# EAGLE design psxpwr (EAGLE 9.5.1)
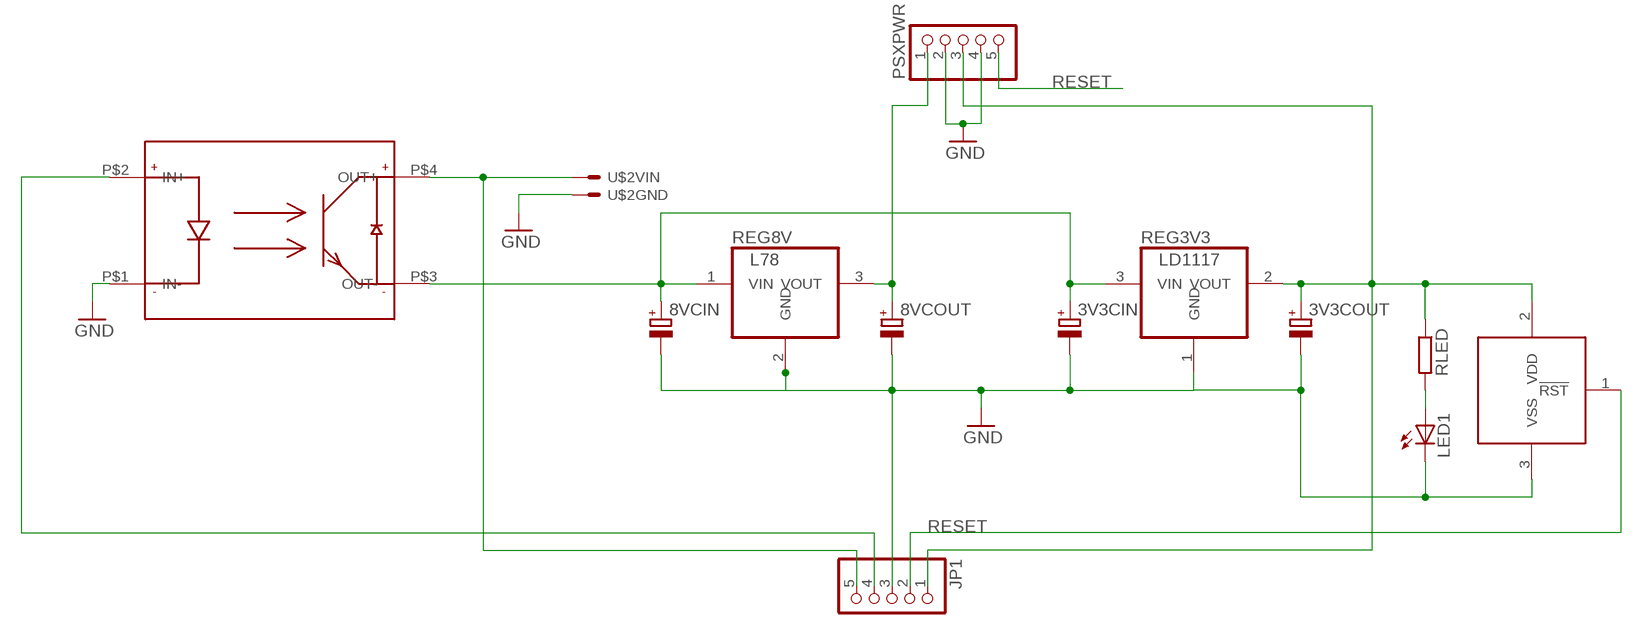
[diagram p0: schematic, sheet 1]

## Parts
3V3CIN  CPOL-EUE2.5-6  [E2,5-6]
3V3COUT  CPOL-EUE2.5-6  [E2,5-6]
8VCIN  CPOL-EUE2.5-6  [E2,5-6]
8VCOUT  CPOL-EUE2.5-6  [E2,5-6]
JP1  PINHD-1X5  [1X05]
LED1  LED3MM  [LED3MM]
PSXPWR  PINHD-1X5  [1X05]
REG3V3  LD1117  [TO-220-HEATSINK]
REG8V  L78  [TO-220-HEATSINK]
RESET  MCP100V3  [TO92-EBC-OVAL]
RLED  R-EU_0207/2V  [0207/2V]
U$1  KF060XD  [KF060XD]
U$2  PWR  [PWR]

## Nets
3V3: 3V3COUT.+ JP1.1 PSXPWR.3 REG3V3.2(VOUT) RESET.2(VDD) RLED.1
8V: 8VCOUT.+ PSXPWR.1 REG8V.3(VOUT)
12V: 3V3CIN.+ 8VCIN.+ REG3V3.3(VIN) REG8V.1(VIN) U$1.P$3(OUT-)
GND: 3V3CIN.- 3V3COUT.- 8VCIN.- 8VCOUT.- JP1.3 LED1.K(C) PSXPWR.2 PSXPWR.4 REG3V3.1(GND) REG8V.2(GND) RESET.3(VSS) U$1.P$1(IN-) U$2.P$1
LED: LED1.A RLED.2
PON: JP1.4 U$1.P$2(IN+)
RESET: JP1.2 PSXPWR.5 RESET.1(!RST)
VIN: JP1.5 U$1.P$4(OUT+) U$2.P$2

## Library data of the parts
3V3CIN 3V3COUT 8VCIN 8VCOUT = rcl:CPOL-EU: POLARIZED CAPACITOR, European symbol; SPICEPREFIX: C
JP1 PSXPWR = pinhead:PINHD-1X5: PIN HEADER
LED1 = adafruit:LED: LED OSRAM: - CHIPLED LG R971, LG N971, LY N971, LG Q971, LY Q971, LO R971, LY R971 LH N974, LH R974 LS Q976, LO Q976, LY Q976 LO Q996 - Hyper CHIPLED LW Q18S LB Q993, LB Q99A, LB R99A - SideLED LS A670, LO A670, LY A670, LG A670, LP A670 LB A673, LV A673, LT A673, LW A673 LH A674 LY A675 LS A676, LA A676, LO A676, LY A676, LW A676 LS A679, LY A679, LG A679 - Hyper Micro SIDELED® LS Y876, LA Y876, LO Y876, LY Y876 LT Y87S - SmartLED LW L88C, LW L88S LB L89C, LB L89S, LG L890 LS L89K, LO L89K, LY L89K LS L896, LA L896, LO L896, LY L896 - TOPLED LS T670, LO T670, LY T670, LG T670, LP T670 LSG T670, LSP T670, LSY T670, LOP T670, LYG T670 LG T671, LOG T671, LSG T671 LB T673, LV T673, LT T673, LW T673 LH T674 LS T676, LA T676, LO T676, LY T676, LB T676, LH T676, LSB T676, LW T676 LB T67C, LV T67C, LT T67C, LS T67K, LO T67K, LY T67K, LW E67C LS E67B, LA E67B, LO E67B, LY E67B, LB E67C, LV E67C, LT E67C LW T67C LS T679, LY T679, LG T679 LS T770, LO T770, LY T770, LG T770, LP T770 LB T773, LV T773, LT T773, LW T773 LH T774 LS E675, LA E675, LY E675, LS T675 LS T776, LA T776, LO T776, LY T776, LB T776 LHGB T686 LT T68C, LB T68C - Hyper Mini TOPLED® LB M676 - Mini TOPLED Santana® LG M470 LS M47K, LO M47K, LY M47K Source: http://www.osram.convergy.de/
REG3V3 = pixel:LD1117
REG8V = pixel:L78
RESET = pixel:MCP100
RLED = rcl:R-EU_: RESISTOR, European symbol; SPICEPREFIX: R
U$1 = pixel:KF060XD
U$2 = pixel:PWR

## Board
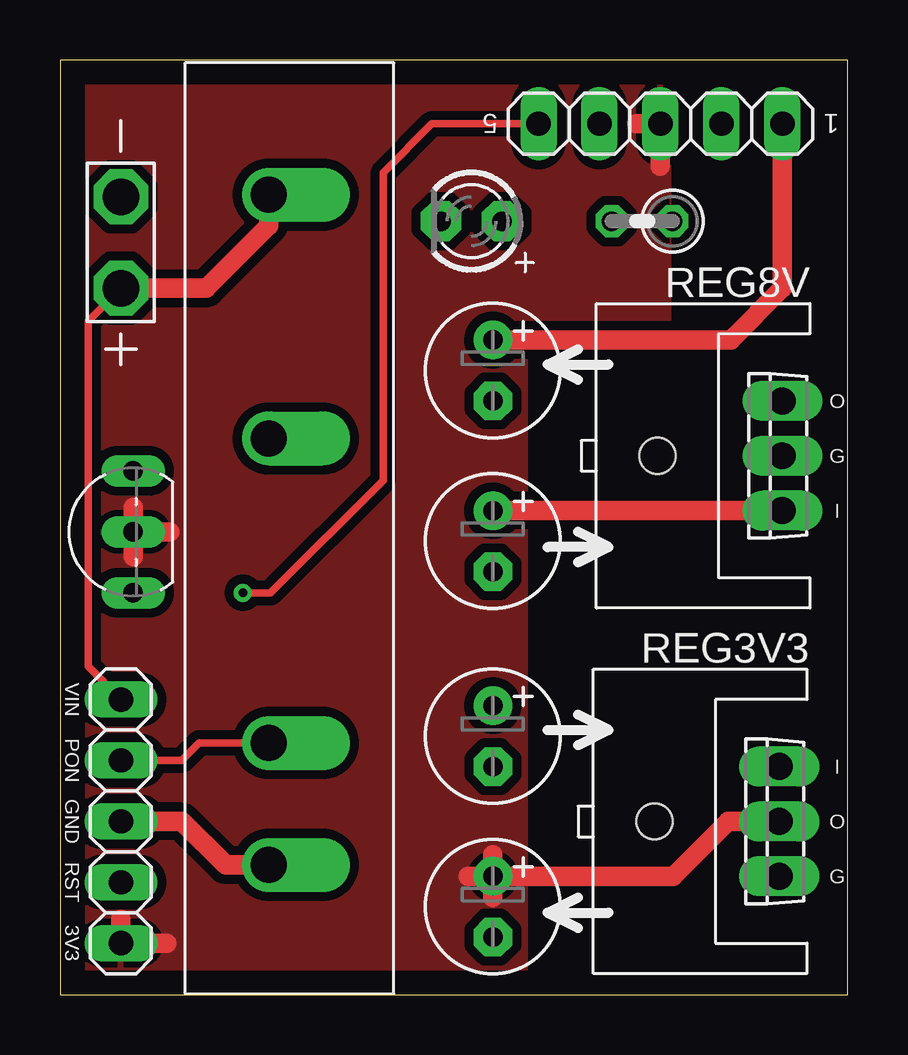
[diagram p1: board, top side]
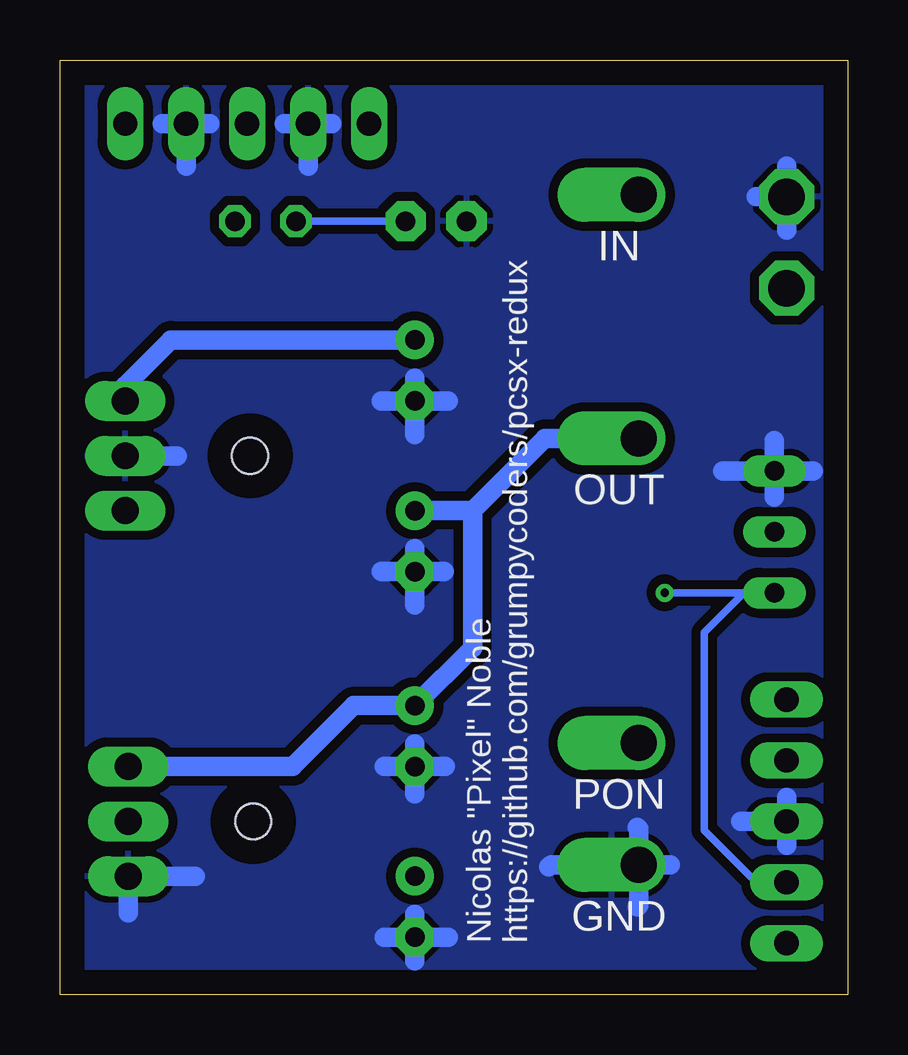
[diagram p2: board, bottom side, seen from below]

Size 32.82 x 38.98 mm. Coordinates in mm from the lower left corner, seen from the top.
Outline: 0,0 32.82,0 32.82,38.98 0,38.98 0,0
Copper layers (1*16): Top 0.035mm / dielectric 1.5mm / Bottom 0.035mm
Design rules "default *": minimum track width 6mil, minimum drill 0.35mm, track to track 15mil, track to pad 15mil, pad to pad 15mil, via to via 15mil, smd to smd 15mil, copper to edge 40mil, drill to drill 6mil, minimum pad ring 10mil, minimum via ring 8mil, stop-mask expansion 4mil, vias tented up to drill 50mil, thermal gap 10mil

### Footprints (pad centres in the part's own frame; a part is rotated, then mirrored left to right if it is on the bottom)
E2,5-6 = drill 0.813 pad 1.6: + -1.27,0 | drill 0.813 pad 1.6 octagon: - 1.27,0
1X05 = drill 1.016 long: 1 -5.08,0; 2 -2.54,0; 3 0,0; 4 2.54,0; 5 5.08,0
LED3MM = drill 0.813 pad 1.676 octagon: A -1.27,0; K 1.27,0
TO-220-HEATSINK = drill 1.118 long: 1 -2.286,-1.397; 2 0,-1.397; 3 2.286,-1.397 | hole 1.5: 0,3.81
TO92-EBC-OVAL = drill 0.813 long: 1 -2.54,-1.27; 2 0,-1.27; 3 2.54,-1.27
0207/2V = drill 0.813 octagon: 1 -1.27,0; 2 1.27,0
KF060XD = drill 1.5 offset: P$1 33.44,3.5; P$2 28.36,3.5; P$3 15.66,3.5; P$4 5.5,3.5
PWR = drill 1.524 octagon: P$1 0,1.905; P$2 0,-1.905

### Placement (x,y rotation side)
3V3CIN  18.03,10.79 270 top
3V3COUT  18.03,3.68 270 top
8VCIN  18.03,18.92 270 top
8VCOUT  18.03,26.04 270 top
JP1  2.54,7.24 90 top
LED1  17.14,32.26 180 top
PSXPWR  25.02,36.32 180 top
REG3V3  28.57,7.24 90 top
REG8V  28.7,22.48 90 top
RESET  1.78,19.3 90 top
RLED  24.26,32.26 180 top
U$1  5.21,38.86 270 top
U$2  2.54,31.37 0 top

### Tracks (layer width: path | path; a pad name or v marks a point on that pad's centre or on a via)
3V3
  Top 0.813: 25.02,34.54 PSXPWR.3 24.03,36.32 | 4.45,2.16 JP1.1 2.54,3.15 | 3V3COUT.+ 18.03,5.84 | 3V3COUT.+ 17.02,4.95 | 3V3COUT.+ 18.03,4.06 | RESET.2 4.57,19.3 | RESET.2 3.05,20.32 | RESET.2 3.05,18.29 | REG3V3.2 27.84,7.24 25.55,4.95 3V3COUT.+
  pour Top: 0,38.99 0,-0.38 19.43,-0.38 19.43,27.3 25.4,27.3 25.4,38.99
8V
  Top 0.813: PSXPWR.1 30.1,29.46 27.94,27.3 8VCOUT.+
  Bottom 0.813: 8VCOUT.+ 28.19,27.3 30.1,25.4 REG8V.3
12V
  Top 0.813: REG8V.1 8VCIN.+
  Bottom 0.813: U$1.P$3 12.61,23.2 15.62,20.19 | 15.62,20.19 8VCIN.+ | 15.62,20.19 15.62,14.48 3V3CIN.+ 20.57,12.06 23.11,9.53 REG3V3.3
GND
  Top 0.813: U$1.P$1 6.9,5.42 5.08,7.24 JP1.3
  Bottom 0.813: REG8V.2 27.94,22.48 | PSXPWR.4 22.48,34.54 | PSXPWR.2 27.56,34.54 | U$2.P$1 2.54,31.88 | U$2.P$1 3.81,33.27 | U$2.P$1 2.54,34.54 | U$1.P$1 8.71,3.74 8.76,3.68 | U$1.P$1 7.41,5.42 7.4,5.43 | U$1.P$1 8.71,6.93 8.76,6.98 | U$1.P$1 12.36,5.42 12.45,5.33 | JP1.3 4.45,7.24 | JP1.3 2.54,6.25 | JP1.3 2.54,8.23 | PSXPWR.4 21.49,36.32 | PSXPWR.4 23.47,36.32 | PSXPWR.2 26.57,36.32 | PSXPWR.2 28.55,36.32 | 3V3CIN.- 19.3,9.53 | 3V3CIN.- 18.03,8.38 | 3V3CIN.- 18.03,10.48 | 3V3CIN.- 16.76,9.53 | 3V3COUT.- 18.03,1.42 | 3V3COUT.- 19.3,2.41 | 3V3COUT.- 18.03,3.37 | 3V3COUT.- 16.64,2.41 | 8VCIN.- 16.82,17.65 | 8VCIN.- 19.43,17.65 | 8VCIN.- 18.03,18.61 | 8VCIN.- 18.03,16.26 | 8VCOUT.- 19.43,24.77 | 8VCOUT.- 18.03,25.72 | 8VCOUT.- 16.64,24.77 | 8VCOUT.- 18.03,23.37 | RESET.3 3.05,23.11 | RESET.3 5.21,21.84 | RESET.3 3.05,20.75 | RESET.3 1.42,21.84 | 29.97,3.43 REG3V3.1 27.18,4.95
  pour Bottom: 0,38.99 0,-0.38 33.02,-0.38 33.02,38.99
LED
  Bottom 0.305: LED1.A RLED.2
PON
  Top 0.305: U$1.P$2 5.8,10.5 5.08,9.78 JP1.4
RESET  (via drill 0.35)
  Top 0.305: PSXPWR.5 15.49,36.32 13.46,34.29 13.46,21.46 8.77,16.76 v7.62,16.76
  Bottom 0.305: JP1.2 3.81,4.7 5.97,6.86 5.97,15.11 4.32,16.76 RESET.1 v7.62,16.76
VIN
  Top 0.305: U$2.P$2 1.17,28.09 1.17,13.69 JP1.5
  Top 0.813: U$2.P$2 6.1,29.46 8.71,32.08 U$1.P$4

### Text on the board
tPlace: O | G | I | I | O | G
tNames: 5 | 1 | VIN | PON | GND | RST | 3V3
bNames: Nicolas "Pixel" Noble / https://github.com/grumpycoders/pcsx-redux